# Altium schematic sheet jtag.SchDoc
size A4; SheetNumber: 12; SheetTotal: 21
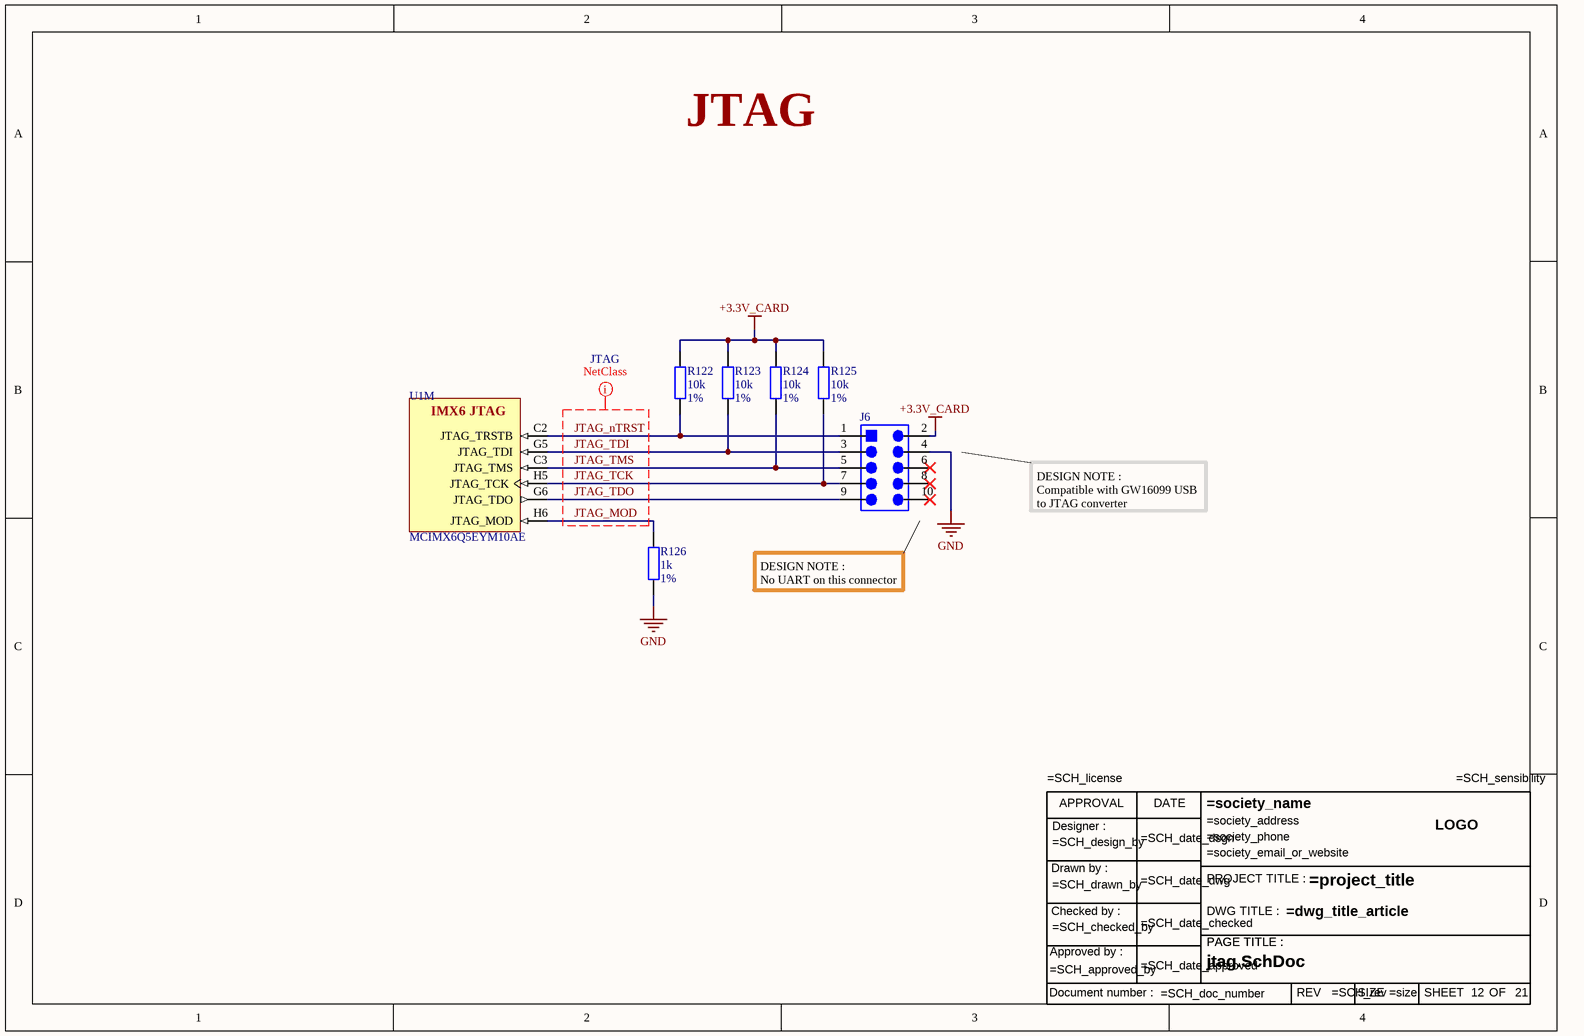
[diagram p0: jtag.SchDoc]

## Parts
J6  header 2 row x10  [header 2row x10]  (value not drawn)
R122  10k  pourcentage: 1%  [Res 0402/1005]
R123  10k  pourcentage: 1%  [Res 0402/1005]
R124  10k  pourcentage: 1%  [Res 0402/1005]
R125  10k  pourcentage: 1%  [Res 0402/1005]
R126  1k  pourcentage: 1%  [Res 0402/1005]
TB11  Title bloc ANSI modified  (value not drawn)
U1  MCIMX6Q5EYM10AE  [FRES-2197-01]  (part M of 21)

## Nets
+3.3V_CARD: J6.2 R122.2 R123.2 R124.2 R125.2
GND: J6.4 R126.1
JTAG_MOD: R126.2 U1.H6(JTAG_MOD)
JTAG_nTRST: J6.1 R122.1 U1.C2(JTAG_TRSTB)
JTAG_TCK: J6.7 R125.1 U1.H5(JTAG_TCK)
JTAG_TDI: J6.3 R123.1 U1.G5(JTAG_TDI)
JTAG_TDO: J6.9 U1.G6(JTAG_TDO)
JTAG_TMS: J6.5 R124.1 U1.C3(JTAG_TMS)

Not connected (* = marked no-connect by the designer): J6 6* 8* 10*

## Layout directives
net class JTAG: JTAG_MOD, JTAG_nTRST, JTAG_TCK, JTAG_TDI, JTAG_TDO, JTAG_TMS

## Notes on the sheet
- JTAG
- DESIGN NOTE :
  Compatible with GW16099 USB to JTAG converter
- DESIGN NOTE :
  No UART on this connector
- (in symbol IMX6Q5EYM10AE, part M) IMX6 JTAG
- (in symbol Title bloc ANSI) APPROVAL; DATE; Designer :; LOGO; Drawn by :; PROJECT TITLE :; Checked by :; DWG TITLE :; PAGE TITLE :; Approved by :; Document number :; REV; SIZE; SHEET; OF

## Library data of the parts
J6 = header 2 row x10: 62131021021
R122-R125 = res 10k 1%: res 10k 1% 0402
R126 = res 1k 1%: res 1k 1% 0402
TB11 = Title bloc ANSI
U1 = IMX6Q5EYM10AE: 32-Bit i.MX 6 Quad Application Processor, 1 GHz, 256 KB RAM, Extended Consumer Grade, 624-Pin FCPBGA, RoHS, Tape and Reel; PartNumber: MCIMX6Q5EYM10ACR; Manufacturer: Freescale Semiconductor; CAN: FlexCAN; Number of Cores: 4 Spec; External Memory Supported: DDR3, DDR3L, FLASH, LPDDR2; Speed Grade: 1 GHz; Core Type: ARM Cortex A9; Cache (KB): 32; Ethernet: 1 Gbps + IEEE 1588; Internal RAM (KB): 256; ComponentLink1Description: Manufacturer URL; ComponentLink2Description: Datasheet; DatasheetVersion: Rev. 2.3; ComponentLink3URL: http://cache.freescale.com/files/32bit/doc/data_sheet/IMX6DQCEC.pdf?fpsp=1&WT_TYPE=Data%20Sheets&WT_VENDOR=FREESCALE&WT_FILE_FORMAT=pdf&WT_ASSET=Documentation; ComponentLink1URL: http://www.freescale.com/; Packing: Tape and Reel; Temperature Range: -20 to 105 degC; ComponentLink2URL: http://cache.freescale.com/files/32bit/doc/data_sheet/IMX6DQCEC.pdf?fpsp=1&WT_TYPE=Data%20Sheets&WT_VENDOR=FREESCALE&WT_FILE_FORMAT=pdf&WT_ASSET=Documentation; ComponentLink3Description: Package Specification; PackageVersion: Rev. A; RoHS: TRUE; Quad/Dual CPU: i.MX 6Quad; Mounting Technology: Surface Mount; PackageReference: FCPBGA-624; PackageDescription: 624-pin Ball Grid Array Package, Body 21 x 21mm, Pitch 0.8mm